# EAGLE board headstage-neuropix (EAGLE 8.3.2)
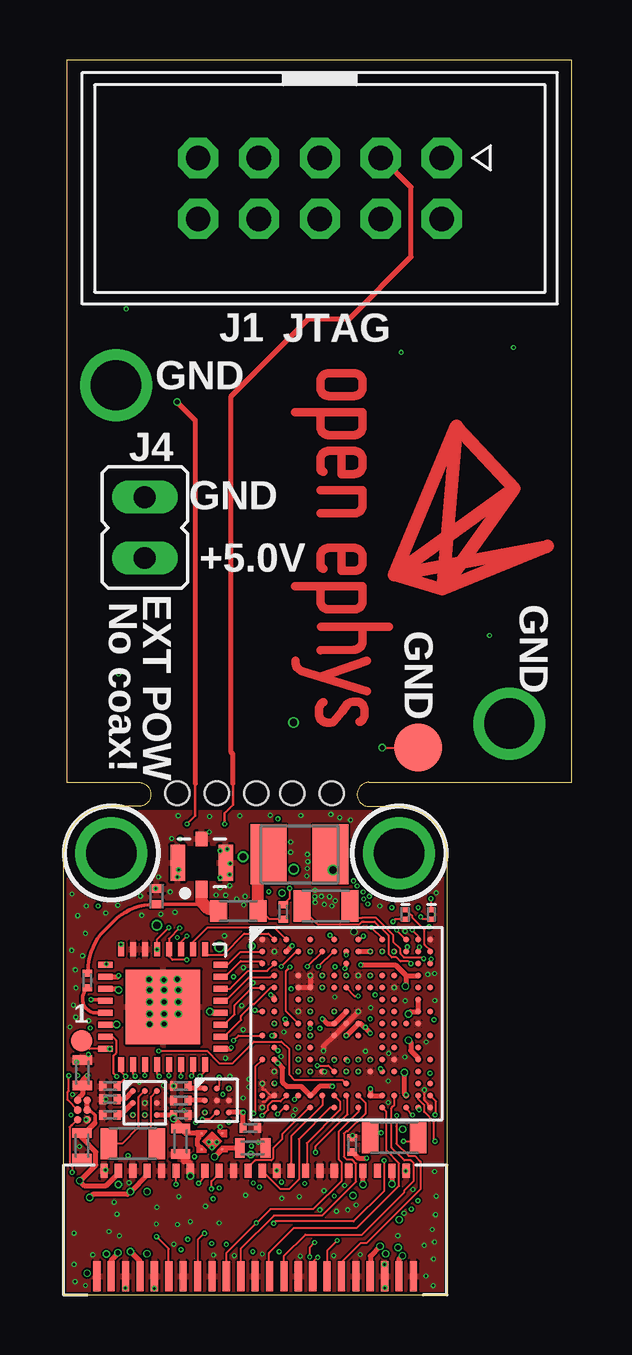
[diagram p5: board, top side]
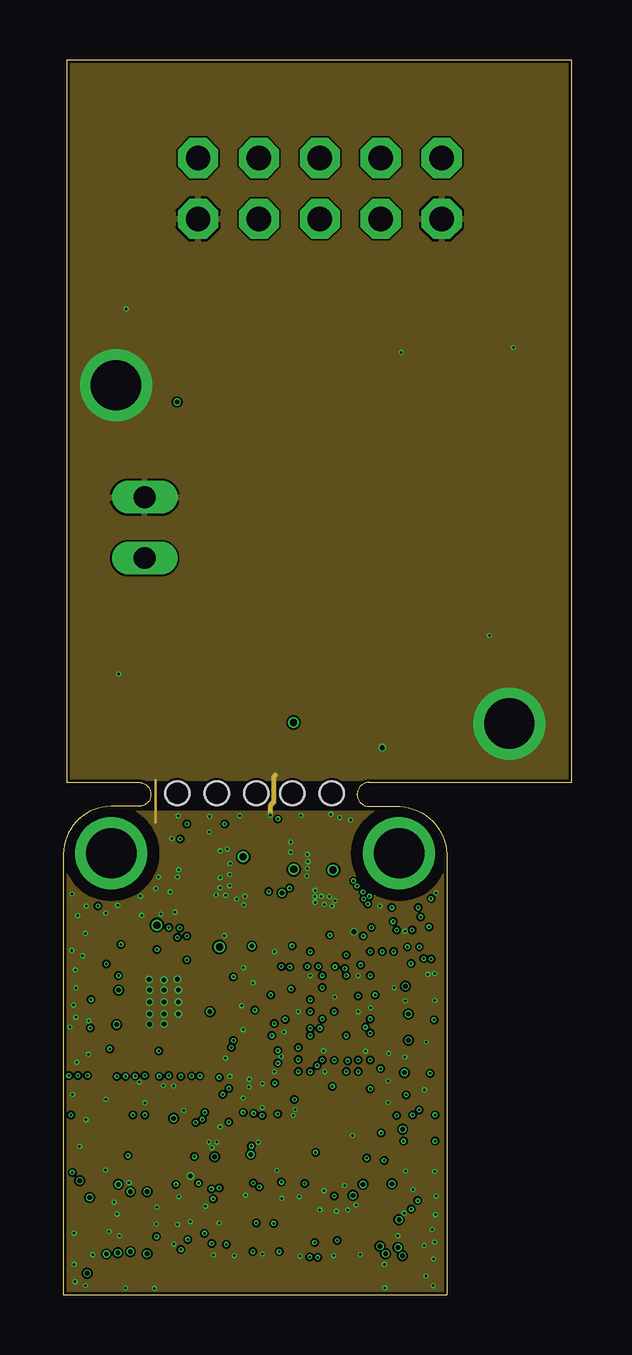
[diagram p6: board, inner layer GND1]
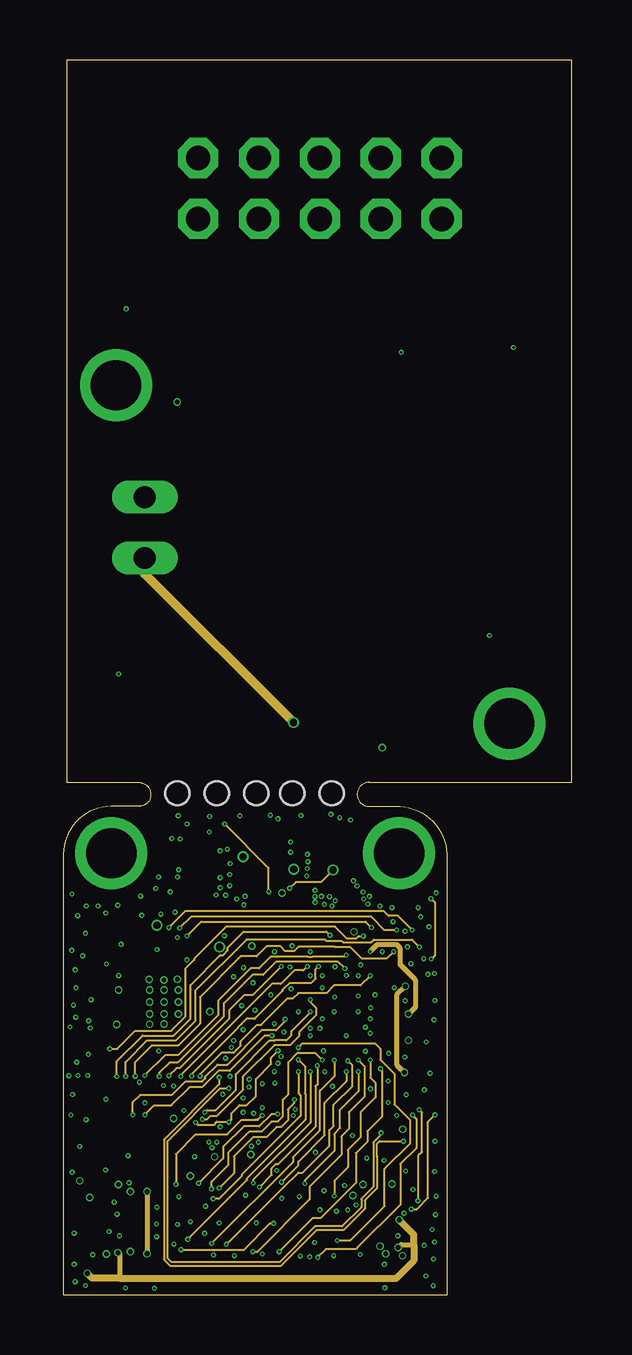
[diagram p7: board, inner layer Highspeed2]
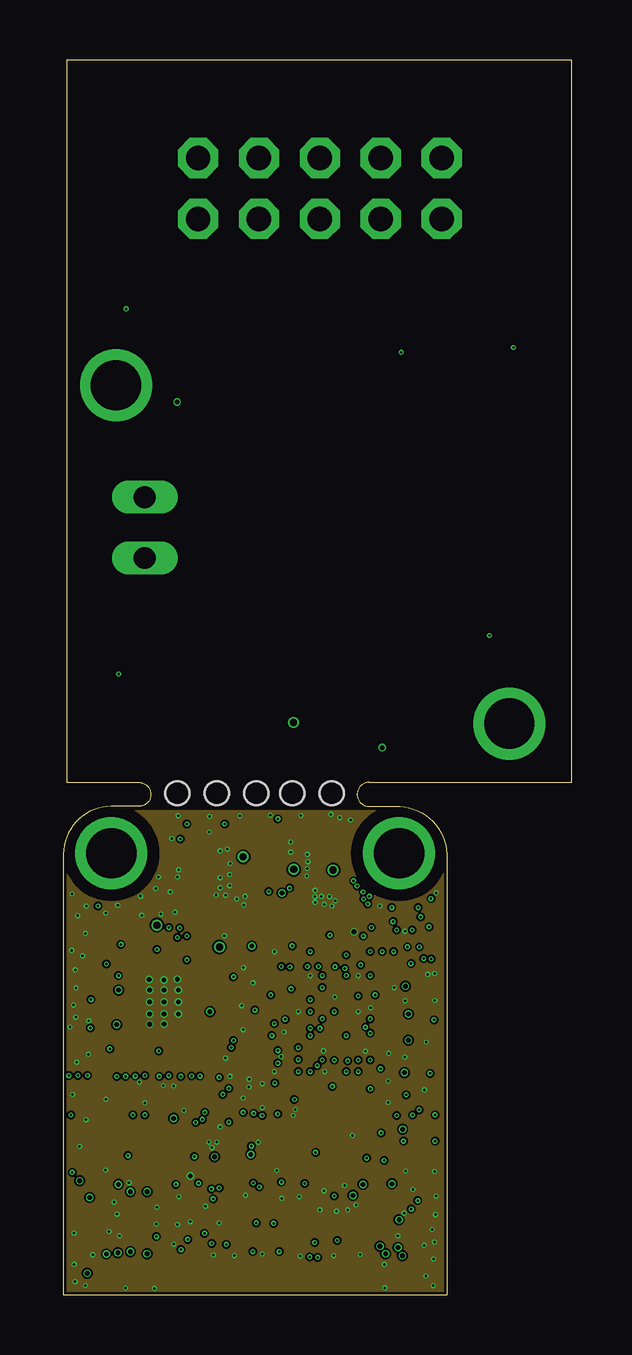
[diagram p8: board, inner layer GND2]
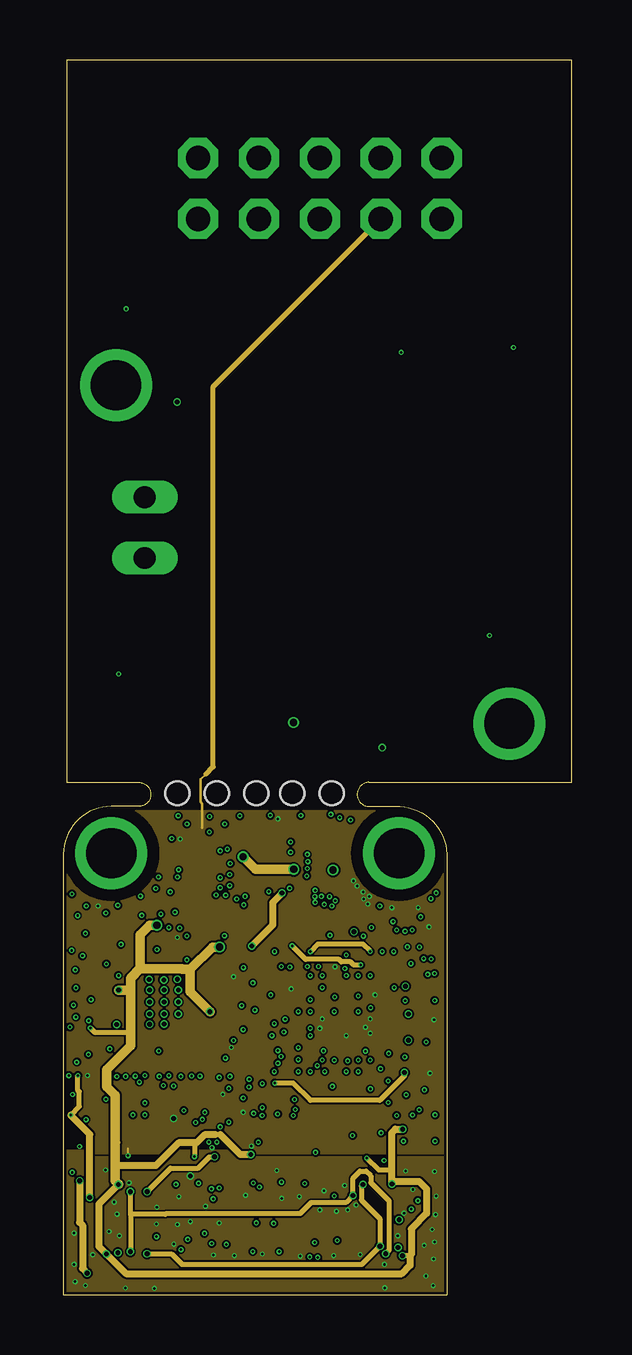
[diagram p9: board, inner layer VCC]
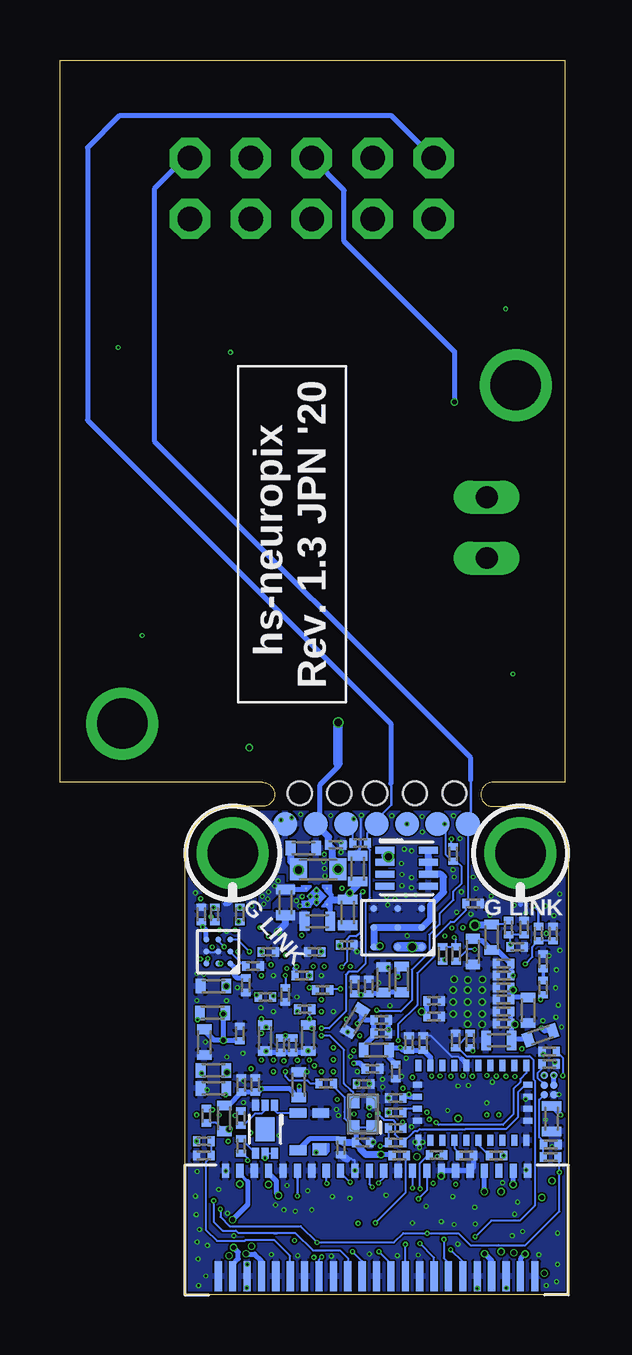
[diagram p10: board, bottom side, seen from below]

Size 21.2 x 51.45 mm. Coordinates in mm from the lower left corner, seen from the top.
Outline: 0.15,51.45 0.15,21.35 3.15,21.35 arc-90 3.65,20.85 arc-90 3.15,20.35 2,20.35 arc90 0,18.35 0,0 16,0 16,18.35 arc90 13.85,20.35 12.75,20.35 arc-90 12.25,20.85 arc-90 12.75,21.35 21.2,21.35 21.2,51.45 0.15,51.45
Copper layers (1*2*3+4*5*16): Highspeed1 0.036mm / dielectric 4mil / GND1 0.036mm / dielectric 5mil / Highspeed2 0.036mm / dielectric 0.10921875mm / GND2 0.036mm / dielectric 5mil / VCC 0.036mm / dielectric 4mil / LowSpeed 0.036mm
Design rules "speedy-6-layer-3mil-trace-space *": minimum track width 3mil, minimum drill 3mil, track to track 3mil, track to pad 3mil, pad to pad 3mil, via to via 3mil, smd to smd 2mil, copper to edge 5mil, drill to drill 5mil, minimum pad ring 2mil, minimum via ring 2mil, stop-mask expansion 0.005mm, vias tented up to drill 1mm, thermal gap 0.1mm
Net classes: 1 diff: width 0.09 mm, drill 0.2 mm, clearance 0.09 mm
Holes 1 mm at 8.05,20.9 4.75,20.9 6.4,20.9 9.55,20.9 11.2,20.9
tKeepout: area 12,16.4 to 16,20.4; area 0,16.4 to 4,20.4
bKeepout: area 11.9,16.3 to 16.1,20.5; area -0.1,16.3 to 4.1,20.5
tRestrict: area -0.1,16.3 to 4.1,20.5; area 11.9,16.3 to 16.1,20.5
bRestrict: area -0.1,16.3 to 4.1,20.5; area 11.9,16.3 to 16.1,20.5
vRestrict: area 11.9,16.3 to 16.1,20.5

## Footprints (pad centres in the part's own frame; a part is rotated, then mirrored left to right if it is on the bottom)
0201T = smd 0.3 x 0.4: 1 -0.3,0; 2 0.3,0
0402T = smd 0.4 x 0.6: 1 -0.533,0; 2 0.533,0
0402TW = smd 0.4 x 0.8: 1 -0.533,0; 2 0.533,0
LED-0201T = smd 0.2 x 0.35: 1 -0.2,0; 2 0.2,0
0402T-DFN = smd 0.35 x 0.6: A -0.325,0; C 0.325,0
0805PT-NOSILK = smd 0.7 x 1.3: A -1,0; C 1,0
2X05_IDC = drill 1.016 pad 1.676 octagon: 1 -5.08,-1.27; 2 -5.08,1.27; 3 -2.54,-1.27; 4 -2.54,1.27; 5 0,-1.27; 6 0,1.27; 7 2.54,-1.27; 8 2.54,1.27; 9 5.08,-1.27; 10 5.08,1.27
X_FL_R_SMT_1(02) = smd 0.5 x 0.7: P$1 0,-1.1 | smd 0.6 x 1.5: P$2 -1,0; P$4 1,0 | smd 0.5 x 0.6: P$3 0,1
FH23-45S-0.3SHW(05) = smd 0.3 x 1.25: 1 -6.6,0.068; 3 -6,0.068; 5 -5.4,0.068; 7 -4.8,0.068; 9 -4.2,0.068; 11 -3.6,0.068; 13 -3,0.068; 15 -2.4,0.068; 17 -1.8,0.068; 19 -1.2,0.068; 21 -0.6,0.068; 23 0,0.068; 25 0.6,0.068; 27 1.2,0.068; 29 1.8,0.068; 31 2.4,0.068; 33 3,0.068; 35 3.6,0.068; 37 4.2,0.068; 39 4.8,0.068; 41 5.4,0.068; 43 6,0.068; 45 6.6,0.068 | smd 0.3 x 0.6: 2 -6.3,4.468; 4 -5.7,4.468; 6 -5.1,4.468; 8 -4.5,4.468; 10 -3.9,4.468; 12 -3.3,4.468; 14 -2.7,4.468; 16 -2.1,4.468; 18 -1.5,4.468; 20 -0.9,4.468; 22 -0.3,4.468; 24 0.3,4.468; 26 0.9,4.468; 28 1.5,4.468; 30 2.1,4.468; 32 2.7,4.468; 34 3.3,4.468; 36 3.9,4.468; 38 4.5,4.468; 40 5.1,4.468; 42 5.7,4.468; 44 6.3,4.468
JP2 = drill 0.914 long: 1 0,0; 2 2.54,0
0603T = smd 0.7 x 0.9: 1 -0.82,0; 2 0.82,0
1210T = smd 1.5 x 2.5: 1 -1.3,0; 2 1.3,0
TP10R = smd 1 x 1: TP 0,0
TP09R = smd 0.9 x 0.9: TP 0,0
TP20R = smd 2 x 2: TP 0,0
MBGA153-8X8 = smd 0.25 x 0.25: A1 -3.5,3.5; A2 -3,3.5; A3 -2.5,3.5; A5 -1.5,3.5; A7 -0.5,3.5; A9 0.5,3.5; A11 1.5,3.5; A13 2.5,3.5; A14 3,3.5; A15 3.5,3.5; B1 -3.5,3; B2 -3,3; B3 -2.5,3; B4 -2,3; B5 -1.5,3; B6 -1,3; B7 -0.5,3; B8 0,3; B9 0.5,3; B10 1,3; B11 1.5,3; B12 2,3; B13 2.5,3; B14 3,3; B15 3.5,3; C1 -3.5,2.5; C2 -3,2.5; C8 0,2.5; C14 3,2.5; C15 3.5,2.5; D2 -3,2; D4 -2,2; D5 -1.5,2; D6 -1,2; D7 -0.5,2; D8 0,2; D9 0.5,2; D10 1,2; D11 1.5,2; D12 2,2; D14 3,2; E1 -3.5,1.5; E2 -3,1.5; E4 -2,1.5; E5 -1.5,1.5; E6 -1,1.5; E7 -0.5,1.5; E8 0,1.5; E9 0.5,1.5; E10 1,1.5; E11 1.5,1.5; E12 2,1.5; E14 3,1.5; E15 3.5,1.5; F2 -3,1; F4 -2,1; F5 -1.5,1; F11 1.5,1; F12 2,1; F14 3,1; G1 -3.5,0.5; G2 -3,0.5; G4 -2,0.5; G5 -1.5,0.5; G7 -0.5,0.5; G8 0,0.5; G9 0.5,0.5; G11 1.5,0.5; G12 2,0.5; G14 3,0.5; G15 3.5,0.5; H2 -3,0; H3 -2.5,0; H4 -2,0; H5 -1.5,0; H7 -0.5,0; H8 0,0; H9 0.5,0; H11 1.5,0; H12 2,0; H13 2.5,0; H14 3,0; J1 -3.5,-0.5; J2 -3,-0.5; J4 -2,-0.5; J5 -1.5,-0.5; J7 -0.5,-0.5; J8 0,-0.5; J9 0.5,-0.5; J11 1.5,-0.5; J12 2,-0.5; J14 3,-0.5; J15 3.5,-0.5; K2 -3,-1; K4 -2,-1; K5 -1.5,-1; K11 1.5,-1; K12 2,-1; K14 3,-1; L1 -3.5,-1.5; L2 -3,-1.5; L4 -2,-1.5; L5 -1.5,-1.5; L6 -1,-1.5; L7 -0.5,-1.5; L8 0,-1.5; L9 0.5,-1.5; L10 1,-1.5; L11 1.5,-1.5; L12 2,-1.5; L14 3,-1.5; L15 3.5,-1.5; M2 -3,-2; M4 -2,-2; M5 -1.5,-2; M6 -1,-2; M7 -0.5,-2; M8 0,-2; M9 0.5,-2; M10 1,-2; M11 1.5,-2; M12 2,-2; M14 3,-2; N1 -3.5,-2.5; N2 -3,-2.5; N8 0,-2.5; N14 3,-2.5; N15 3.5,-2.5; P1 -3.5,-3; P2 -3,-3; P3 -2.5,-3; P4 -2,-3; P5 -1.5,-3; P6 -1,-3; P7 -0.5,-3; P8 0,-3; P9 0.5,-3; P10 1,-3; P11 1.5,-3; P12 2,-3; P13 2.5,-3; P14 3,-3; P15 3.5,-3; R1 -3.5,-3.5; R2 -3,-3.5; R3 -2.5,-3.5; R5 -1.5,-3.5; R7 -0.5,-3.5; R9 0.5,-3.5; R11 1.5,-3.5; R13 2.5,-3.5; R14 3,-3.5; R15 3.5,-3.5
ASCO = smd 0.6 x 0.5: 1 -0.55,-0.4; 2 0.55,-0.4; 3 0.55,0.4; 4 -0.55,0.4
UDFN8-2X2 = smd 0.8 x 0.3: 1 -0.91,0.75; 2 -0.91,0.25; 3 -0.91,-0.25; 4 -0.91,-0.75; 5 0.91,-0.75; 6 0.91,-0.25; 7 0.91,0.25; 8 0.91,0.75
WLCSP6-1X1.2-LP = smd 0.305 x 0.305: A1 -0.2,0.4; A2 0.2,0.4; B1 -0.2,0; B2 0.2,0; C1 -0.2,-0.4; C2 0.2,-0.4
WQFN32-5X5-LP = smd 0.25 x 0.6: 1 1.75,2.4; 2 1.25,2.4; 3 0.75,2.4; 4 0.25,2.4; 5 -0.25,2.4; 6 -0.75,2.4; 7 -1.25,2.4; 8 -1.75,2.4; 17 -1.75,-2.4; 18 -1.25,-2.4; 19 -0.75,-2.4; 20 -0.25,-2.4; 21 0.25,-2.4; 22 0.75,-2.4; 23 1.25,-2.4; 24 1.75,-2.4 | smd 0.6 x 0.25: 9 -2.4,1.75; 10 -2.4,1.25; 11 -2.4,0.75; 12 -2.4,0.25; 13 -2.4,-0.25; 14 -2.4,-0.75; 15 -2.4,-1.25; 16 -2.4,-1.75; 25 2.4,-1.75; 26 2.4,-1.25; 27 2.4,-0.75; 28 2.4,-0.25; 29 2.4,0.25; 30 2.4,0.75; 31 2.4,1.25; 32 2.4,1.75 | smd 3.1 x 3.1: PAD 0,0
X2SON = smd 0.1 x 0.1: 1 -0.43,0.33; 2 -0.43,-0.33; 3 0.43,-0.33; 4 0.43,0.33 | smd 0.1 x 0.1 rotated 45: PAD 0,0
MICROSIP9-3X2.3 = smd 0.3 x 0.3: A1 -1,0.8; A2 0,0.8; A3 1,0.8; B1 -1,0; B2 0,0; B3 1,0; C1 -1,-0.8; C2 0,-0.8; C3 1,-0.8
LGA-28-3.8X2.5-LP = smd 0.25 x 0.475: 1 -2.25,1.56; 6 -2.25,-1.56; 7 -1.75,-1.56; 8 -1.25,-1.56; 9 -0.75,-1.56; 10 -0.25,-1.56; 11 0.25,-1.56; 12 0.75,-1.56; 13 1.25,-1.56; 14 1.75,-1.56; 15 2.25,-1.56; 20 2.25,1.56; 21 1.75,1.56; 22 1.25,1.56; 23 0.75,1.56; 24 0.25,1.56; 25 -0.25,1.56; 26 -0.75,1.56; 27 -1.25,1.56; 28 -1.75,1.56 | smd 0.375 x 0.25: 2 -2.3,0.75; 3 -2.3,0.25; 4 -2.3,-0.25; 5 -2.3,-0.75; 16 2.3,-0.75; 17 2.3,-0.25; 18 2.3,0.25; 19 2.3,0.75
VFLGA4-2.0X1.6 = smd 0.5 x 0.57: 1 -0.725,-0.425 | smd 0.4 x 0.7: 2 0.775,-0.475; 3 0.775,0.475; 4 -0.775,0.475
DFN6_2X1.3_PAD = smd 0.45 x 0.3: 1 -1,0.4; 2 -1,0; 3 -1,-0.4; 4 1,-0.4; 5 1,0; 6 1,0.4 | smd 1 x 0.8: PAD 0,0
WLCSP3X3 = smd 0.25 x 0.25: A1 -0.5,0.5; A2 0,0.5; A3 0.5,0.5; B1 -0.5,0; B2 0,0; B3 0.5,0; C1 -0.5,-0.5; C2 0,-0.5; C3 0.5,-0.5

## Placement (x,y rotation side)
C1  22nF  [0201T]  9.24,14.58 0 bottom
C2  22nF  [0201T]  11.5,10.4 270 bottom
C3  0.1uF  [0201T]  8.53,8.78 0 bottom
C4  0.1uF  [0201T]  12,10.4 270 bottom
C5  4.7uF  [0402T]  14.8,12.86 180 bottom
C6  4.7uF  [0402T]  12.65,10.7 270 bottom
C7  10uF  [0402T]  14.8,8.6 180 bottom
C8  10uF  [0402T]  10.85,10.7 270 bottom
C9  22nF  [0201T]  8.17,9.42 0 bottom
C10  22nF  [0201T]  13.7,10.89 90 bottom
C11  10nF  [0201T]  8.58,6.34 180 bottom
C12  22nF  [0201T]  8.32,12.85 90 bottom
C13  22nF  [0201T]  7.8,11.45 0 bottom
C14  22nF  [0201T]  13.64,8.75 90 bottom
C15  22nF  [0201T]  12.51,14.29 0 bottom
C16  0.1uF  [0201T]  8.91,12.84 90 bottom
C17  0.1uF  [0201T]  7.8,10.9 0 bottom
C18  0.1uF  [0201T]  13.05,8.75 90 bottom
C19  0.1uF  [0201T]  10.58,14.29 180 bottom
C20  10uF  [0402T]  8.9,11.42 238.2 bottom
C21  10uF  [0402T]  11.25,8.75 90 bottom
C22  10uF  [0402T]  15.18,10.53 270 bottom
C23  10uF  [0402T]  7.71,13.13 90 bottom
C24  10uF  [0402TW]  0.8,9.25 90 top
C25  1uF  [0201T]  9.7,18.75 0 bottom
C26  10uF  [0402TW]  9.2,15.93 270 bottom
C27  0.1uF  [0201T]  7.2,8.2 180 bottom
C28  10uF  [0402TW]  8.78,17.76 90 bottom
C29  0.1uF  [0201T]  6.05,10.5 90 bottom
C30  1nF  [0201T]  0.8,10.14 180 bottom
C31  0.1uF  [0201T]  5.6,12.25 0 bottom
C32  0.1uF  [0201T]  7.2,9.3 270 bottom
C33  10uF  [0402TW]  0.78,6.21 270 top
C34  10nF  [0201T]  5.6,11.6 0 bottom
C35  10nF  [0201T]  6.65,10.5 90 bottom
C36  10uF  [0402TW]  10.47,15.56 180 bottom
C37  10uF  [0402TW]  4.89,6.4 270 top
C38  1uF  [0201T]  0.73,6.26 0 bottom
C39  0.1uF  [0201T]  4.25,5.8 180 bottom
C40  10nF  [0201T]  2.7,13.8 180 bottom
C41  10nF  [0201T]  2.7,12.8 180 bottom
C42  10nF  [0201T]  2.7,11.8 180 bottom
C43  1nF  [0201T]  0.8,9.62 0 bottom
C44  0.1uF  [0201T]  2.7,13.3 180 bottom
C45  0.1uF  [0201T]  2.7,12.3 180 bottom
C46  0.1uF  [0201T]  2.7,11.3 180 bottom
C47  10uF  [0402TW]  11.8,16.35 270 bottom
C48  10uF  [0402TW]  7.9,6.12 0 top
C49  0.1uF  [0201T]  1,13.1 270 top
C50  47nF  [0201T]  1.05,12.8 270 bottom
C51  10uF  [0402TW]  0.7,7.34 270 bottom
C52  4.7uF  [0402T]  3.98,14.3 270 bottom
C53  10uF  [0402T]  1.68,11.86 270 bottom
C54  10uF  [0402TW]  2.9,10.6 180 bottom
C55  1uF  [0201T]  0.63,15.05 90 bottom
C56  10nF  [0201T]  9.48,6.13 90 bottom
C57  0.1uF  [0201T]  2.13,14.5 0 bottom
C58  10uF  [0402T]  11.05,18.61 0 bottom
C59  10nF  [0201T]  12.05,6.25 270 top
C60  1uF  [0201T]  1.95,8.15 180 top
C61  1uF  [0201T]  4.9,8.7 180 top
C62  1uF  [0201T]  13.45,12.9 270 bottom
C63  0.1uF  [0201T]  4.9,7.5 0 top
C64  0.1uF  [0201T]  7.8,6.95 0 top
C65  0.1uF  [0201T]  15.3,15.85 90 bottom
D1  XZVGR155W  [LED-0201T]  15.35,15.85 270 top
D2  XZVGR155W  [LED-0201T]  14.25,15.85 270 top
D3  SESD0402X1UN-0020-090  [0402T-DFN]  3.89,16.6 270 top
D4  VEMD1160X01  [0805PT-NOSILK]  2.9,6.3 0 top
D5  VEMD1160X01  [0805PT-NOSILK]  13.8,6.55 180 top
D6  VEMD1160X01  [0805PT-NOSILK]  10.95,16.2 0 top
J1  302-S101  [2X05_IDC]  10.7,46.1 180 top
J2  X.FL-R-SMT-1(02)  [X_FL_R_SMT_1(02)]  5.77,18 0 top
J3  FH23-45S-0.3SHW(05)  [FH23-45S-0.3SHW(05)]  8,0.7 0 top
J4  77311-118-02LF  [JP2]  3.4,30.7 90 top
J5  FH23-45S-0.3SHW(05)  [FH23-45S-0.3SHW(05)]  8,0.7 0 bottom
L1  BLM15PX601SN1D  [0402T]  14.8,9.35 0 bottom
L2  BLM15PX601SN1D  [0402T]  6.95,13.14 270 bottom
L3  BLM15PX601SN1D  [0402T]  8,10.2 180 bottom
L4  BLM15PX601SN1D  [0402T]  14.35,7.35 90 bottom
L5  BLM15PX601SN1D  [0402T]  14.84,11.75 0 bottom
L6  BLM15PX601SN1D  [0402T]  3.2,14.9 270 bottom
L7  BLM15PX601SN1D  [0402T]  1.16,10.82 198.9 bottom
L8  BLM18KG601SN1D  [0603T]  10.43,17.73 0 bottom
L9  ADL3225V-470MT-TL000  [1210T]  9.85,18.35 0 top
L10  MPZ1608S102ATA00  [0603T]  7.3,16 0 top
R1  4.7k  [0201T]  7.2,6.35 180 bottom
R2  4.7k  [0201T]  7.2,6.95 180 bottom
R3  2k  [0201T]  14.75,15.85 270 bottom
R4  4.7k  [0201T]  10.1,8.8 0 bottom
R5  10k  [0201T]  11,11.9 180 bottom
R6  2k  [0201T]  13.7,15.85 270 bottom
R7  4.7k  [0201T]  15.1,7.46 270 bottom
R8  10k  [0201T]  4.8,18.37 270 bottom
R9  1k  [0201T]  3.97,16.3 0 bottom
R10  4.7k  [0201T]  5.5,5.82 0 bottom
R11  4.7k  [0201T]  5.24,14.2 90 bottom
R12  10k  [0201T]  11.8,12.5 270 bottom
R13  10k  [0201T]  8.68,18.83 0 bottom
R14  4.7k  [0201T]  7.05,5.8 180 bottom
R15  4.7k  [0201T]  4.68,14.2 90 bottom
R16  10k  [0201T]  12.63,12.41 0 bottom
R17  10k  [0201T]  11.1,13.3 0 bottom
R18  10k  [0201T]  10.25,12.7 180 bottom
R19  10k  [0201T]  1.95,8.7 180 top
R20  10k  [0201T]  3,5.8 0 bottom
R21  6.6k  [0201T]  0.74,5.74 0 bottom
R22  10k  [0201T]  1.25,15.05 270 bottom
R23  49.9  [0201T]  1.05,13.9 270 bottom
R24  10k  [0201T]  7.2,7.6 0 bottom
R25  10k  [0201T]  2.5,15.3 270 bottom
R26  100k  [0201T]  1.85,15.3 90 bottom
R27  2k  [0201T]  9.17,15.95 90 top
R28  22  [0201T]  13.65,6.2 270 bottom
R29  20k  [0201T]  4.1,10.6 90 bottom
R30  100  [0201T]  4.7,10.6 90 bottom
R31  22  [0201T]  13.66,7.36 90 bottom
R32  15k  [0201T]  1.95,7.5 0 top
R33  15k  [0201T]  4.9,8.1 0 top
R34  15k  [0201T]  13.15,13.7 180 bottom
R35  20k  [0201T]  15.2,6.4 0 bottom
R36  100  [0201T]  15.2,5.8 180 bottom
TP1  [TP10R]  10.54,19.62 180 bottom
TP2  [TP10R]  5.46,19.62 180 bottom
TP3  [TP10R]  4.19,19.62 180 bottom
TP4  [TP10R]  8,19.62 180 bottom
TP5  [TP10R]  6.73,19.62 180 bottom
TP6  [TP10R]  9.27,19.62 180 bottom
TP7  [TP10R]  11.81,19.62 180 bottom
TP8  [TP09R]  0.76,10.58 0 top
TP9  [TP20R]  14.8,22.8 270 top
U1  10M08SAM15317G  [MBGA153-8X8]  11.8,11.3 0 top
U2  ASCO2-24.000MHZ-EK-T3  [ASCO]  8.57,7.53 90 bottom
U3  MAX4945AELA+T  [UDFN8-2X2]  6.74,17.77 0 bottom
U4  ADP7112ACBZ-1.8-R7  [WLCSP6-1X1.2-LP]  0.8,7.7 0 top
U5  DS90UB933_WQFN  [WQFN32-5X5-LP]  4.16,12 0 top
U6  NCP161BMX330  [X2SON]  10.5,16.6 0 bottom
U7  TPS8268180  [MICROSIP9-3X2.3]  7.11,15.3 180 bottom
U8  TLV70712  [X2SON]  6.2,6.4 180 top
U9  ADP7112ACBZ-1.2-R7  [WLCSP6-1X1.2-LP]  0.81,8.74 0 bottom
U10  BNO055  [LGA-28-3.8X2.5-LP]  4,8 0 bottom
U11  DSC6102MI2A-093.6000  [VFLGA4-2.0X1.6]  10.8,6.8 90 bottom
U12  PL133-27GC-R  [DFN6_2X1.3_PAD]  12.65,6.9 270 bottom
U13  TS4231  [WLCSP3X3]  3.4,8 0 top
U14  TS4231  [WLCSP3X3]  6.4,8.1 0 top
U15  TS4231  [WLCSP3X3]  14.6,14.3 180 bottom
X2  OE-LOGO_14X10  [OE-LOGO-14X10]  13.4,31.8 270 top

## Tracks (layer width: path | path; a pad name or v marks a point on that pad's centre or on a via)
1V2A  (via drill 0.1, 0.2)
  Highspeed1 0.2: J3.7 3.2,1.4 v2.8,1.8 | J3.8 3.5,5 v2.8,4.3 2.68,4.18 1.23,4.18 v1.1,4.05
  VCC 0.2: 2.8,3.35 v2.8,4.3 | 2.8,3.35 v2.8,1.8 | 2.8,3.35 4.26,3.35 4.29,3.38 9.88,3.38 10.34,3.84 11.78,3.84 v12.08,4.14 12.08,4.86 12.37,5.15 12.63,5.15 12.83,4.95 12.83,4.67 13.6,3.9 13.6,1.87 v13.44,1.71 | U9.A2 0.61,8.52 0.67,8.46 0.67,7.84 v0.32,7.49
  VCC 0.3: v1.1,4.05 1.1,6.68 0.32,7.47 v0.32,7.49
  LowSpeed 0.2: v13.44,1.71 13.36,1.71 13.34,1.69 13.08,1.69 12.8,1.41 J5.7 | v12.08,4.14 12.17,4.23 12.17,4.73 12.5,5.06 J5.8 | U9.B2 U9.A2 | v0.32,7.49 C51.1
  other vias: 0.61,9.14
1V8A  (via drill 0.2)
  Highspeed1 0.15: 1.33,7.16 1.33,7.47 1.1,7.7 U4.B2
  Highspeed1 0.2: J3.4 2.3,5.07 1.76,4.53 1.24,4.53 0.9,4.53 v0.68,4.75 0.7,4.75 1.36,5.4 1.36,5.95 0.78,6.53 C33.1 0.91,6.74 1.33,7.16 | J3.3 2,1.44 2.28,1.71 v2.28,1.76 | U4.B2 U4.A2
  Highspeed2 0.2: 2.34,0.7 2.34,1.76 v2.28,1.76 | v13.96,1.97 14.08,2.09 14.62,2.09
  Highspeed2 0.3: v1,0.9 1.2,0.7 2.34,0.7 13.9,0.7 14.62,1.42 14.62,2.09 14.62,2.51 v14,3.12
  VCC 0.3: v1,0.9 0.8,1.1 0.8,2.9 0.68,3.02 v0.68,4.75
  LowSpeed 0.15: J5.4 13.7,5.05 13.37,4.72
  LowSpeed 0.2: J5.3 14,0.94 14.01,0.94 14.01,1.25 13.77,1.5 13.77,1.78 v13.96,1.97 | v14,3.12 13.37,3.76 13.37,4.72
24MHZ_P  (via drill 0.1)
  LowSpeed 0.076: U1.J5 9.95,10.8 9.36,10.21 9.36,8.8 9.09,8.54 9.09,8.53 8.97,8.41 U2.3
  other vias: 10.3,10.8
!IMU_BL
  LowSpeed 0.076: U10.4 6.75,7.75 R24.2
!IMU_RESET
  LowSpeed 0.076: U10.11 3.75,6.25 R20.1
+1V2  (via drill 0.2)
  Highspeed1 0.076: 6.86,6.12 6.81,6.07 U8.1
  Highspeed1 0.2: v13.21,2.02 12.8,1.61 J3.39 | v12.5,4.6 J3.38 | 6.86,6.12 C48.1 | U8.1 v6.31,5.75
  Highspeed2 0.2: v3.49,1.71 v3.5,1.72 v3.5,4.3
  VCC 0.2: v6.31,5.75 6.1,5.75 5.62,5.28 4.47,5.28 v3.5,4.3 | v12.5,4.6 12.43,4.53 12.43,3.94 13.2,3.17 v13.2,2.03 v13.21,2.02 12.45,1.26 10.47,1.26 10.46,1.27 4.95,1.27 4.51,1.71 v3.49,1.71
  LowSpeed 0.2: v3.5,4.3 J5.38 | J5.39 3.2,1.42 v3.49,1.71
+1V8  (via drill 0.1, 0.2, 0.3)
  Highspeed1 0.2: U5.28 6.16,11.75 v6.11,11.8 | U5.11 2.31,12.75 v2.31,12.7 | J3.42 v13.7,4.62 | C59.2 12.3,5.7 v12.65,5.7 | J3.43 14,1.48 v14.15,1.63
  VCC 0.2: 13.7,5.19 13.16,5.19 v12.65,5.7 | 5.45,6.35 5.47,6.33 v5.47,5.76 | 6.35,6.69 6.54,6.69 6.55,6.67 | 14.46,1.62 v14.16,1.62 v14.15,1.63 | 2.78,10.6 2.81,10.57 | v1.13,11.12 1.31,10.93 2.73,10.93 2.81,11.01
  VCC 0.3: v14.15,6.9 13.85,6.9 13.7,6.75 13.7,5.19 v13.7,4.62 13.8,4.72 14.84,4.72 15.15,4.41 15.15,3.39 14.51,2.75 14.51,1.67 14.46,1.62 14.46,1.23 14.12,0.88 2.62,0.88 v1.8,1.7 1.49,2.01 1.49,3.79 v2.3,4.6 | v7.82,5.85 7.37,5.85 6.55,6.67 | 6.35,6.69 5.92,6.69 5.58,6.35 5.45,6.35 4.83,6.35 3.87,5.39 2.16,5.39 | 2.23,6.35 2.16,6.42
  VCC 0.4: 2.81,12.7 2.81,13.2 3.21,13.6 | 2.81,12.7 2.81,11.01 2.81,10.57 2.81,10.38 1.8,9.37 1.8,8.66 2.16,8.31 2.16,6.42 2.16,5.39 2.16,4.74 v2.3,4.6 | v2.31,12.7 2.81,12.7 | 3.21,13.6 3.21,15.01 3.6,15.4 v3.9,15.4 | 5.29,13.57 5.29,12.62 v6.11,11.8 | 5.29,13.57 5.3,13.58 5.31,13.58 6.22,14.49 v6.51,14.49 | 5.29,13.57 4.96,13.57 4.96,13.58 3.23,13.58 3.21,13.6
  LowSpeed 0.076: L4.1 14.69,7.16 R7.2 | R25.1 2.67,15.43 L6.1 | U2.1 8.84,6.98 U2.4 9.35,7.36 9.35,7.62 9.33,7.63 9.33,8.23 9.8,8.7 R4.2 | 8.85,6.37 C11.2 | U12.5 U12.6
  LowSpeed 0.15: 12.65,6.05 U12.5 | L4.1 14.17,6.82 14.15,6.8
  LowSpeed 0.2: 5.9,11.8 C31.1 | 5.9,11.8 C34.1 | v6.11,11.8 5.9,11.8 | v2.3,4.6 J5.42 | v7.82,5.85 7.4,5.85 R14.2 | R10.2 5.26,5.76 v5.47,5.76 | U12.5 v12.65,5.7 | v1.8,1.7 2,1.5 J5.43 | 8.85,6.86 U2.4 8.81,6.98 | C11.2 8.84,6.38 8.84,6.98 | C53.1 2.31,12.39 C45.1 | U11.4 10.8,6.5 9.55,6.5 C56.2 | L7.1 1,10.99 v1.13,11.12
  LowSpeed 0.203: C41.1 v2.31,12.7
  LowSpeed 0.3: L6.1 3.23,15.4 v3.9,15.4 | C45.1 C41.1 | L4.1 14.23,6.82 v14.15,6.9 | C56.2 9.39,6.34 C11.2 8.66,6.12 8.66,6.05 8.46,5.85 v7.82,5.85
  LowSpeed 0.4: 6.52,14.5 U7.A2 | 6.52,14.5 v6.51,14.49 | U7.A1 6.52,14.5
+3V3  (via drill 0.1, 0.2)
  Highspeed1 0.2: U1.J8 U1.H9 12.4,11.3 v12.8,10.9 | U1.G8 U1.H7 11,11.3 v10.8,11.5 | U8.3 5.65,6.73 | U13.C3 C63.1 v4.6,7.35 4.89,7.06 C37.1 5.09,6.73 5.65,6.73 | U14.C3 R24.1 C64.1 | U5.25 6.96,10.25 v7.01,10.3 | 5.65,6.73 5.65,6.54 5.6,6.48 5.6,6.24 U8.4 | U9.A1 0.8,8.93 C24.1 0.8,8.37 0.6,8.16 U4.A1
  VCC 0.076: R20.2 2.7,6.09
  VCC 0.1: 5.95,21.7 5.72,21.47 5.72,20.54 5.79,20.47 5.79,19.45
  VCC 0.2: J1.4 6.25,37.84 6.25,22 5.95,21.7
  LowSpeed 0.076: C64.1 R1.2 7.66,6.19 v7.84,6.19 | R11.2 R15.2 4.68,14.81 v4.76,14.89 | R6.1 v13.7,16.13 | R5.1 10.8,11.8 v10.8,11.5 | R18.1 9.9,12.75 v9.5,12.75 | TP6.TP 9.27,19.56 8.98,19.27 R13.1 | R8.1 4.88,18.75 v4.88,19
  LowSpeed 0.1: v1.45,16.2 1.25,16 R22.1
  LowSpeed 0.15: 6.6,8.25 6.66,8.26
  LowSpeed 0.2: C2.1 11.75,10.7 | 11.75,10.7 C4.1 | 11.75,10.7 11.75,10.75 arc-90 U1.J8 | 6.6,8.25 U10.3 | 6.6,8.25 6.85,8.25 C27.1 | v11.33,13.67 11.4,13.6 R17.1 | TP6.TP 9.16,19.62 v8.95,19.83 | U6.1 10.98,16.88 C47.1 | U15.C3 15.1,15.18 v15.25,15.33 15.25,15.5 C65.1 | C32.1 7.47,9.87 L3.1 7.37,10.3 v7.01,10.3 6.91,10.2 C35.1 C29.1 5.75,9.9 U10.28 | v10.8,11.5 10.8,11.28 C8.1 | v12.8,11.5 12.8,11.38 C6.1 | L5.1 15.37,11.55 v15.46,11.46 | R3.1 14.78,16.15 v14.8,16.13 | v6.65,8.35 6.65,8.3 6.6,8.25 | v7.1,13.25 7.1,13.52 L2.1
  LowSpeed 0.203: R16.1 v12.99,12.51 v13,12.5 | L1.1 15.33,9.27 v15.29,9.23
  LowSpeed 0.3: C47.1 11.75,16.93
  other vias: 11.8,10.8 7.5,7.6 10.7,11.1 12.6,11.15 2.7,5.8 12.25,17.03 12.5,16.78 12.76,16.6 12.7,16.28 12.1,17.25 12.53,16.49 1.01,9.14
  pour VCC (rank 3, no thermals): 0,20.15 0,5.9 16,5.9 16.05,15.75 16,20.15
  pour LowSpeed (rank 2, no thermals): 11.45,17.1 11.45,16.65 12.2,16.65 12.45,16.4 12.45,16.1 12.9,16.1 12.9,16.65 12.08,17.47 11.85,17.47 11.85,17.1
BNO_SCL  (via drill 0.1)
  Highspeed1 0.076: U1.L1 8,9.5 8,7.62 v7.94,7.56
  LowSpeed 0.076: U10.19 1.8,8.75 2.1,8.45 2.1,7.4 2.6,6.9 4.3,6.9 6.21,6.9 6.3,6.81 6.42,6.81 6.45,6.78 6.47,6.78 R1.1 | v7.94,7.56 7.76,7.38 7.76,7.35 7.7,7.29 7.32,7.29 7.24,7.2 7.24,6.69 R1.1 | R1.1 6.86,6.35
BNO_SDA  (via drill 0.1)
  Highspeed1 0.076: v8.95,10.17 8.82,10.3 U1.K2
  Highspeed2 0.076: v8.95,10.17 8.66,9.89 8.66,9.62 8.03,8.99 8.03,8.28 7.65,7.9 7.35,7.9 7,7.55 7,7.29 v6.91,7.2 6.89,7.21 6.41,7.21 | v5.52,7.18 5.6,7.09 6.29,7.09 6.36,7.16 | 6.36,7.16 6.41,7.21 | 6.41,7.21 6.36,7.16
  LowSpeed 0.076: U10.20 1.75,9.25 2.01,8.99 2.01,8.86 2.29,8.59 2.29,7.52 2.73,7.08 5.42,7.08 v5.52,7.18 | R2.1 v6.9,7.19 v6.91,7.2
CAL_A_1KHZ  (via drill 0.1)
  Highspeed1 0.076: U1.N8 11.65,8.95 9.65,8.95 9.43,9.18 9.43,10.22 9.1,10.55 7.95,10.55 7.05,9.64 6.5,9.64 5.99,10.16 v3.98,10.16
  LowSpeed 0.076: R29.1 4.1,10.28 v3.98,10.16
CAL_B_1KHZ  (via drill 0.1)
  Highspeed1 0.076: U1.P14 14.8,8.15 15.05,7.89 15.05,7.62 15.46,7.21 15.46,6.44 R35.1
  other vias: 15.5,6.4
CAL_SIGNAL_A  (via drill 0.1)
  Highspeed1 0.076: 4.4,0.29 J3.11 4.4,1.91 v3.88,2.42
  LowSpeed 0.076: v3.88,2.42 3.22,3.09 2.02,3.09 1.4,3.71 1.4,8.92 1.46,8.98 1.46,9.79 1.61,9.95 4.26,9.95 4.61,10.3 R30.1 R29.2
CAL_SIGNAL_A1
  LowSpeed 0.076: R35.2 R36.1 14.9,5.75 15.11,5.54 15.11,2.7 14.66,2.25 13.5,2.25 13.46,2.29 12.27,2.29 11.6,1.62 J5.11
CONF_DONE  (via drill 0.1)
  LowSpeed 0.076: R18.2 10.65,12.8 U1.E6
  other vias: 10.8,12.8
CONFIG_SEL  (via drill 0.1)
  Highspeed1 0.09: U1.D8
  LowSpeed 0.076: U1.D8 R12.1
  other vias: 11.8,13.3
GND  (via drill 0.1, 0.2, 2.1 pad 3)
  Highspeed1 0.076: U1.R15 15.21,7.89 15.21,7.96 15.06,8.11 v15.06,8.54
  Highspeed1 0.09: v13.3,22.8 TP9.TP
  Highspeed1 0.1: U1.M6 v10.9,9.3 | 8.33,8.05 8.4,8.05 8.58,8.22 8.72,8.22 U1.P2 8.65,8.3 8.4,8.55 8.32,8.55 8.3,8.57 U1.N1
  Highspeed1 0.2: U1.G9 U1.H8 U1.J7 10.85,10.35 C8.2 | U1.D5 U1.E5 U1.E4 | C59.1 v12.06,6.64 | v5.3,4.95 5.3,5.46 5.22,5.54 5.03,5.54 5.03,5.77 4.99,5.77 C37.2
  GND1 0.1: 3.85,21.45 3.85,19.7
  GND1 0.2: 8.85,21.65 8.78,21.58 8.78,20.52 8.63,20.37 v8.63,19.98
  LowSpeed 0.076: U15.B3 14.96,14.3 14.94,14.28 14.76,14.28 14.74,14.3 U15.B2 | v8.63,19.98 8.66,19.95 8.66,18.64 8.67,18.63 | J5.20 8.9,5.61 8.91,5.61 8.92,5.62 8.99,5.62 9.03,5.66 9.22,5.66 | U10.25 4.51,9.82 4.51,9.85 4.58,9.91 4.85,9.91 5.74,10.8 C29.2
  LowSpeed 0.1: v10.9,9.3 11.23,9.3 C21.2
  LowSpeed 0.127: 8.67,18.63 8.69,18.61 8.69,18.57 8.78,18.48 C28.2
  LowSpeed 0.15: v0.8,14.13 0.98,14.13 R23.1
  LowSpeed 0.2: C6.2 arc-90 12.53,10.1 C4.2 C2.2 10.97,10.1 arc-90 C8.2 | C13.2 v7.5,11.05 C17.2 | 8.14,6.36 v8.13,6.36 | v2,18.4 2,16.26 | v14,18.4 14,16.5 14.22,16.28 14.3,16.28 | C1.2 8.94,14.43 v8.81,14.3 | C39.1 3.95,5.32 J5.36 J5.34 J5.32 v5.3,4.95 | U10.25 4.25,9.63 4.45,9.83 | U9.C2 v0.39,8.34 v0.39,8.35
  LowSpeed 0.3: v12.12,15.13 11.8,15.45 C47.2 | U6.PAD 10.83,16.27 U6.2 | C11.1 8.26,6.36 8.14,6.36 | 9.22,5.66 9.26,5.69 9.34,5.69 C56.1
  other vias: 3.58,13.14 4.19,13.12 4.76,13.15 4.8,12.7 4.2,12.7 3.6,12.7 3.6,12.2 3.6,11.7 4.2,12.2 4.2,11.7 3.6,11.27 4.2,11.28 12.3,11.8 4.8,12.2 4.8,11.7 12.6,10.15 13.55,8.91 12.3,13.3 14.25,12.25 14.24,9.91 7.51,13.63 8.3,8.8 8.3,7.8 7.5,8.2 10.85,10.17 9.8,11.8 9.2,10.95 6.54,7 6.95,9.1 7.75,8.98 10.3,13.3 13.8,12.8 4.6,8.7 5.03,7.68 1.78,8.15 11.73,4.56 14.28,5.16 9.88,1.61 8.3,1.7 6.26,1.66 7.13,1.63 10.7,3.54 7.6,4.15 5.3,3.05 3.9,3.65 3.85,16.93 10.5,16.85 0.36,16.7 15.48,5.14 6.94,17.51 7.53,16.25 0.45,1.27 4.52,19.01 10.17,17.76 3.97,17.41 3.22,16.61 2.27,16.23 1.77,15.91 0.92,15.06 3.27,15.81 4.07,15.86 12.82,11.96 11.32,12.41 13.57,10.06 3.17,8.86 2.12,3.86 1.91,2.64 11.98,19.78 11.53,19.88 2.34,2.46 11.86,3.54 0.92,0.39 0.49,0.55 0.45,2.57 0.68,6.18 15.12,0.78 15.44,1.49 15.38,2.72 15.52,3.34 15.48,2.2 15.05,2.06 12.38,1.68 9.11,4.02 5.93,3.69 4.82,4.09 4.76,2.93 3.88,2.95 4.17,8.72 1.06,11.42 0.52,11.57 0.53,12.79 0.5,13.54 0.35,14.35 0.6,15.8 15.48,13.39 15.49,12.26 15.13,10.53 17.77,27.47 14.09,39.27 2.62,41.08 2.31,25.87 9.08,9.93 4.66,15.94 0.56,9.69 7.44,12.05 6.76,9.86 13.55,8.01 18.77,39.47 14.58,4.39 2.24,3.36 6.94,17.05 4.46,16.79 6.96,17.97 10.2,18.05 10.15,17.45 0.96,16.2 7.58,16.6 11.2,16.2 10.5,16.35 10.76,16.6 13.2,16.2 14.25,15.15 15.55,16.75 15.2,13.35 6.09,19.28 6.72,14.96 7.74,8.66 15.55,4.11 12.21,3.74 9.84,4.09 6.54,18.5 7.23,16.49 6.84,18.57 4.81,17.71 6.77,16.65 6.37,16.66 7.91,13 7.36,19.96 6.1,19.93 6.54,17.38 4.79,19.96 1.23,1.67 0.28,11.16 3.4,8 8.9,5.18 10.87,4.34 6.4,6.36 6.07,6.36 6.2,6.13 11.1,16.59 10.88,16.27 11.28,1.63 13.41,0.29 13.95,2.46 13.39,1.27 14.21,3.4 11.39,3.48 1.76,5.2 9.48,18.87 9.48,18.44 10.18,18.35 11.16,20.02 0.42,12.07 9.67,7.72 9.59,7.47 8.8,9.3 9.91,19.97 1.05,10.02 2.74,4.67 0.95,7.3 2.59,0.28 3.8,0.27 11.34,16.42 10.49,16.59 18.6,23.8 2.2,37.9 15.42,0.38 4.61,2.11 6.5,2.99 4.76,17.41 6.54,16.96
  pour LowSpeed (rank 2): 2.6,14.1 2.6,10.3 5.7,10.3 5.7,13.6 4.1,13.6 4.1,14.1
  pour GND2 (rank 3, no thermals): 0,20.15 0,-9.6 16,-9.6 16.05,15.75 16,20.15
  pour GND1 (rank 3): -42,58.5 -42,-8 58,-8 58,58.5
  pour LowSpeed (rank 3): 0,20.15 0,-11.65 16,-11.65 16.05,15.75 16,20.15
  pour Highspeed1 (rank 3): 0,20.15 0,-7.3 16,-7.3 16.05,15.75 16,20.15
  pour VCC (rank 4): 0,-9 16,-9 16,6 0,6
I2C_SCL_A  (via drill 0.1)
  Highspeed1 0.076: 8.05,2.98 v8.05,3 | 8.05,2.98 8.04,2.96 8.02,2.96 6.8,1.75 J3.19 | 8.05,2.98 8.63,3.56 10.41,3.56 11.61,4.76 11.61,5.51 11.48,5.64 11.48,6.8 12.3,7.62 U1.R9
  LowSpeed 0.076: R14.1 6.78,5.78 6.78,4.28 v8.05,3
I2C_SCL_B  (via drill 0.1)
  Highspeed1 0.076: U1.R14 14.84,7.76 v14.84,7.71
  Highspeed2 0.076: v14.84,7.71 14.96,7.59 14.96,5.95 14.79,5.79 v14.79,3.93 v14.79,3.92
  LowSpeed 0.076: 9.2,1.4 J5.19 9.2,1.53 9.52,1.85 10.66,1.85 11.38,2.57 12.29,2.57 | v14.84,7.71 15.1,7.71 R7.1 | 12.29,2.57 12.12,2.57 | 12.29,2.57 13.76,2.57 13.86,2.67 14.41,2.67 14.79,3.05 v14.79,3.92
I2C_SDA_A  (via drill 0.1)
  Highspeed1 0.076: 6.5,5.1 J3.18 6.5,5.06 6.18,4.74 v6.18,4.42 | U1.L6 v10.8,9.78
  Highspeed2 0.076: v6.18,4.42 6.18,4.71 6.88,5.42 6.88,5.93 7.76,6.81 8.28,6.81 8.68,7.21 8.93,7.21 9.15,7.44 9.15,8.13 9.38,8.36 9.38,9.7 9.74,10.05 10.53,10.05 v10.8,9.78
  LowSpeed 0.076: v6.18,4.42 6.2,4.44 6.2,5.48 5.86,5.82 R10.1
I2C_SDA_B  (via drill 0.1)
  Highspeed2 0.076: U1.M8 11.8,8.9 10.9,8 10.9,6.65 9.8,5.55 9.8,5.4 v9.1,4.69
  LowSpeed 0.076: 9.5,5.1 J5.18 9.5,5.09 v9.1,4.69 9.54,5.13 9.54,5.29 | R4.1 10.75,8.8 10.87,8.93 11.63,8.93 11.8,9.1 U1.M8
  other vias: 11.8,9.3
JTAGEN  (via drill 0.1)
  LowSpeed 0.076: R5.2 U1.G7
  other vias: 11.3,11.8
LH_DATA0  (via drill 0.1)
  Highspeed2 0.076: U14.C1 6,7.7 6.35,7.7 7.2,8.55 7.2,9.2 8.59,10.59 8.79,10.59 8.8,10.6 9.3,10.6 9.51,10.81 9.51,10.99 10.3,11.78 U1.G5
  other vias: 5.9,7.6 10.3,11.8
LH_DATA1  (via drill 0.1)
  Highspeed1 0.076: U1.H3 9.3,11.43 v9.25,11.48
  Highspeed2 0.076: v9.25,11.48 9.25,11.4 8.87,11.02 8.27,11.02 6.84,9.59 6.43,9.59 5.92,9.08 5.92,9.02 5.79,8.9 5.7,8.9 5.7,8.89 5.1,8.89 4.52,8.32 3.2,8.32 2.88,8 2.88,7.52 U13.C1
  other vias: 2.9,7.5
LH_DATA2  (via drill 0.1)
  LowSpeed 0.076: U1.B11 13.8,14.8 U15.C1
  other vias: 13.3,14.3
LH_ENV0  (via drill 0.1)
  Highspeed1 0.076: v5.8,7.31 6.11,7.31 U14.C2
  Highspeed2 0.076: U1.F5 10.3,12.2 10.54,11.96 10.54,11.64 10.21,11.32 9.85,10.96 9.85,10.79 9.46,10.4 8.8,10.4 7.5,9.1 7.5,8.55 6.41,7.46 6.14,7.46 5.98,7.3 v5.81,7.3 v5.8,7.31
  other vias: 10.3,12.3
LH_ENV1  (via drill 0.1)
  Highspeed1 0.076: U1.J2 v8.7,10.8
  Highspeed2 0.076: U13.C2 3.79,7.89 4.5,7.89 5.26,8.65 5.79,8.65 6.47,9.34 6.94,9.34 8.4,10.8 v8.7,10.8
  other vias: 3.4,7.5
LH_ENV2  (via drill 0.1)
  Highspeed1 0.076: U1.B13 14.35,14.35 v14.35,14.5
  LowSpeed 0.076: U15.C2 14.6,14.75 v14.35,14.5
MIDFILT
  Highspeed1 0.076: R27.1 8.61,15.65 8.26,16 L10.2
  Highspeed1 0.5: 8.52,17.58 8.55,17.61 8.55,17.9 | 8.55,17.9 L9.1 8.55,17.9 | 8.32,17.67 8.55,17.9 | 8.55,17.9 8.55,17.39 | L10.2 8.12,17.47 8.55,17.9
N$1
  LowSpeed 0.076: U12.1 12.25,7.7 12.12,7.58 U11.3
N$2
  LowSpeed 0.076: R28.1 U12.4
N$3  (via drill 0.1)
  Highspeed1 0.076: 11.6,0.7 J3.35 | J3.35 11.6,0.31 11.61,0.3 | J3.35 11.6,1.35 12.4,2.15 12.64,2.15 14.89,4.4 14.89,5.54 14.65,5.79 14.4,5.79 13.88,6.3 13.88,7.01 13.9,7.03 v13.9,7.47
  LowSpeed 0.076: v13.9,7.47 13.71,7.66 R31.2
N$4  (via drill 0.1)
  LowSpeed 0.2: L3.2 8.53,10.37 8.1,10.8 C17.1 C13.1 | C13.1 8.14,11.41 | 8.62,11.6 C20.1 | 8.62,11.6 8.62,11.48 U1.H2 | C13.1 8.47,11.45 8.62,11.6
  other vias: 8.8,11.3
N$5  (via drill 0.1)
  Highspeed1 0.076: v13.37,5.59 13.37,4.32 12.11,3.06 8.86,3.06 v8.77,2.98
  Highspeed2 0.076: v8.77,2.98 8.63,2.98 7.54,1.89 v4.92,1.89 v4.91,1.88
  LowSpeed 0.076: R28.2 13.58,5.9 13.37,5.69 v13.37,5.59 | v4.91,1.88 4.4,1.37 J5.35
N$6
  LowSpeed 0.076: R31.1 13.55,7.06 13.07,7.54 12.79,7.54 12.65,7.69 U12.2
N$7
  Highspeed1 0.076: 3.7,6.7 3.7,6.6 | D4.C 3.7,6.5 3.7,6.7 | 3.7,6.7 3.7,6.75 3.66,6.79 3.66,8.26 U13.A3
N$8
  Highspeed1 0.076: D4.A 2.45,6.3 3.15,7 3.15,8.25 U13.A2
N$9
  Highspeed1 0.2: U13.B1 2.4,7.5 R32.2
N$10
  cutout GND1: 0,18.4 arc-90 2,20.4 arc-90 4,18.4 arc-90 2,16.4 arc-90
N$11
  cutout LowSpeed: 0,18.4 arc-90 2,20.4 arc-90 4,18.4 arc-90 2,16.4 arc-90
N$12
  Highspeed1 0.2: U13.A1 2.55,8.15 C60.1
N$13  (via drill 0.1, 0.3)
  Highspeed1 0.076: L9.2 11.15,17.7 v11.25,17.7 | v9.44,16.94 9.44,16.52 R27.2
  Highspeed2 0.076: v11.25,17.7 10.75,17.2 9.7,17.2 v9.44,16.94
  LowSpeed 0.3: 11.33,17.7 v11.25,17.7 L8.1 11.58,18.06 C58.1
N$14  (via drill 0.1)
  Highspeed1 0.076: D5.C 12.8,6.75 v13.25,6.75 | 6.93,8.6 U14.A3
  Highspeed2 0.076: v13.25,6.75 13.25,6.68 13.04,6.47 12.93,6.35 12.93,4.5 12.43,4 12.43,3.65 11.62,2.85 10.5,2.85 9.01,1.36 4.52,1.36 4.35,1.53 4.35,6.41 6.54,8.6 U14.A3 6.93,8.6
  other vias: 6.9,8.6
N$15  (via drill 0.1)
  Highspeed1 0.076: 14.65,6.51 14.57,6.51 14.46,6.4 v14.18,6.4 | 14.65,6.51 14.77,6.4 | v6.5,9.06 6.5,8.7 U14.A2 | D5.A 14.65,6.55 14.65,6.51
  Highspeed2 0.076: v14.18,6.4 13.19,6.4 13.08,6.29 13.08,5.75 | v6.5,9.06 6.5,8.77 4.2,6.47 4.2,1.47 4.46,1.21 9.07,1.21 10.56,2.7 11.69,2.7 12.58,3.59 12.58,3.94 13.08,4.44 13.08,5.75 | 13.08,5.79 13.08,5.75
N$16
  Highspeed1 0.2: U14.B1 R33.2
N$17
  cutout VCC: 0,18.4 arc-90 2,20.4 arc-90 4,18.4 arc-90 2,16.4 arc-90
N$18
  cutout GND2: 0,18.4 arc-90 2,20.4 arc-90 4,18.4 arc-90 2,16.4 arc-90
N$19
  cutout Highspeed1: 0,18.4 arc-90 2,20.4 arc-90 4,18.4 arc-90 2,16.4 arc-90
N$20
  cutout GND1: 12,18.4 arc-90 14,20.4 arc-90 16,18.4 arc-90 14,16.4 arc-90
N$21
  cutout LowSpeed: 12,18.4 arc-90 14,20.4 arc-90 16,18.4 arc-90 14,16.4 arc-90
N$22
  cutout VCC: 12,18.4 arc-90 14,20.4 arc-90 16,18.4 arc-90 14,16.4 arc-90
N$23
  cutout GND2: 12,18.4 arc-90 14,20.4 arc-90 16,18.4 arc-90 14,16.4 arc-90
N$24
  cutout Highspeed1: 12,18.4 arc-90 14,20.4 arc-90 16,18.4 arc-90 14,16.4 arc-90
N$25
  cutout GND1: 2.65,21.4 2.65,20.2 13.25,20.2 13.25,21.4
N$26  (via drill 0.1)
  Highspeed1 0.076: 12.15,16.2 D6.C 11.95,15.7 12.46,15.7 13.05,15.7 13.75,15 13.75,14.71 14.05,14.41 14.05,14.25 | 14.05,14.22 14.05,14.25 | 14.05,14.25 14.05,14.21 14.2,14.06 14.97,14.06 v15.03,14.01
  LowSpeed 0.076: U15.A3 15.1,13.94 v15.03,14.01
N$27  (via drill 0.1)
  Highspeed1 0.076: D6.A 9.95,16.1 10.6,15.45 11.54,15.45 11.55,15.44 12.35,15.44 12.46,15.55 12.52,15.55 12.98,15.55 13.56,14.97 13.56,14.2 13.7,14.06 13.9,14.06 14.06,13.9 14.4,13.9 v14.5,13.8
  LowSpeed 0.076: U15.A2 v14.5,13.8
N$28
  Highspeed1 0.15: 1,12.78 C49.2 C49.2 arc45 0.8,12.32 arc66 1.14,11.8 1.25,11.75 U5.13
N$29
  LowSpeed 0.076: U15.B1 13.5,13.7 R34.2
N$30  (via drill 0.1)
  Highspeed1 0.076: 1.83,13.82 U5.9 v1.8,13.78
  LowSpeed 0.076: C55.1 R22.2 1.5,14.5 1.5,14.08 v1.8,13.78
N$31  (via drill 0.1)
  Highspeed1 0.15: v1.16,12.3 1.71,12.3 U5.12
  LowSpeed 0.15: C50.2 1.05,12.41 v1.16,12.3
N$32
  LowSpeed 0.15: C50.1 R23.2
N$33  (via drill 0.1)
  Highspeed1 0.076: U5.8 v2.41,14.6
  LowSpeed 0.076: R26.1 R25.2 2.43,14.93 C57.1 2.43,14.58 v2.41,14.6
N$34  (via drill 0.1)
  Highspeed1 0.2: U5.10 2.26,13.25 v2.31,13.3
  LowSpeed 0.076: C44.1 v2.31,13.3
  LowSpeed 0.2: C44.1 C40.1 2.97,14.37 L6.2 3.58,14.75 3.8,14.75 3.89,14.83 C52.1
N$35  (via drill 0.2)
  Highspeed1 0.2: U5.14 v2.23,11.26
  LowSpeed 0.2: C46.1 2.37,11.27 C54.1 2.32,10.65 L7.2 | C46.1 C42.1 | C46.1 2.27,11.3 v2.23,11.26
N$36
  Highspeed1 0.2: U14.A1 5.3,8.6 C61.1
N$37
  LowSpeed 0.2: U15.A1 13.93,13.62 13.93,13.32 13.8,13.2 C62.1
N$38  (via drill 0.2)
  VCC 0.3: v7.86,14.53 8.74,15.41 8.74,16.35 9.12,16.73 v9.12,16.74
  LowSpeed 0.1: 9.9,16.52 9.9,16.48 9.88,16.46
  LowSpeed 0.2: C36.1 9.94,16.14 U6.3 10.07,16.34 9.9,16.52 9.9,16.68 10.07,16.86 U6.4 10.07,16.91 | U3.7 5.83,18.22
  LowSpeed 0.3: U3.8 5.83,18.22 U3.6 5.31,17.52 5.2,17.41 5.2,16.78 5.73,16.25 5.73,15.68 U7.B1 U7.B2 U7.B3 U7.A3 7.89,14.5 v7.86,14.53 | 9.95,15.3 9.94,15.31 C36.1 | v9.12,16.74 9.18,16.68 | C28.1 8.78,17.08 v9.12,16.74 | v9.12,16.74 9.2,16.66 C26.1 9.88,16.46 9.96,16.38
N$39  (via drill 0.1)
  Highspeed1 0.076: 0.6,7.72 U4.B1 0.18,8.12 0.18,8.44 0.23,8.49 v0.23,9.13
  LowSpeed 0.076: C30.1 0.23,9.87 v0.23,9.13
N$40
  LowSpeed 0.076: U9.B1 1.01,8.76 1.28,9.03 1.28,9.25 1.1,9.43 C43.1
N$41
  LowSpeed 0.076: R21.1 C38.1 1.03,6.38 1.21,6.56 1.21,8.14 U9.C1
N$67
  LowSpeed 0.076: U10.9 4.75,6.1 4.55,5.9 C39.2
N$92  (via drill 0.1)
  Highspeed1 0.076: D2.2 13.85,15.65 v13.75,15.55
  LowSpeed 0.076: R6.2 v13.75,15.55
N$93  (via drill 0.1)
  Highspeed1 0.076: D1.2 15,15.65 v14.9,15.75
  LowSpeed 0.076: v14.9,15.75 14.9,15.7 R3.2
NCONFIG  (via drill 0.1)
  Highspeed1 0.076: U1.E8 12.15,12.45 v12.3,12.45
  LowSpeed 0.076: 12.36,12.51 v12.3,12.45 12.33,12.45 R16.2
NP_OSC_EN  (via drill 0.1)
  Highspeed1 0.076: U1.P8 11.86,8.25 11.86,7.52 10.52,6.18 v10.52,5.93
  LowSpeed 0.076: U11.1 v10.52,5.93
NRST  (via drill 0.1)
  Highspeed1 0.076: v15.5,7.5 15.54,7.54 15.54,8.06 U1.P15 | J3.15 5.62,0.79 5.62,2.31 5.87,2.56 v5.89,2.56 | v10.28,1.58 10.28,1.98 v10.48,2.18 | U4.C1 0.36,7.06 0.33,7.06 0.27,6.99 0.27,5.43 0.37,5.32 v0.37,5.1
  Highspeed2 0.076: v15.5,7.5 15.21,7.21 15.21,4.04 14.74,3.57 v14.51,3.57
  LowSpeed 0.076: 10.4,1.3 10.4,1.1 | 10.4,1.1 J5.15 10.4,1.46 v10.28,1.58 | 10.29,1.21 10.4,1.1 | v14.51,3.57 14.51,3.25 14.12,2.86 11.16,2.86 v10.48,2.18 7.27,2.18 6.88,2.57 v5.9,2.57 v5.89,2.56 4.58,2.56 4.08,2.06 2.92,2.06 2.91,2.06 1.79,2.06 0.37,3.48 v0.37,5.1 0.37,5.67 R21.2
NSTATUS  (via drill 0.1)
  LowSpeed 0.076: 10.9,13.3 U1.D6
  other vias: 10.8,13.3
OSC_PDOWN_N_A  (via drill 0.1)
  Highspeed1 0.076: v4.7,4.6 J3.12 | v8.29,7.47 8.38,7.56 8.4,7.56 8.54,7.7 8.54,7.89 8.71,8.06 9.06,8.06 U1.P3
  Highspeed2 0.076: v4.7,4.6 4.7,5.86 5.52,6.68 6.83,6.68 7.44,7.29 8,7.29 | 8,7.29 8.08,7.29 | v8.29,7.47 8.11,7.29 8,7.29
OSC_PDOWN_N_B  (via drill 0.1)
  Highspeed1 0.076: U1.L10 v12.8,9.78
  Highspeed2 0.076: v12.8,9.78 12.8,9.05 13.02,8.83 13.02,8.22 12.4,7.6 12.4,6.57 11.87,6.04 11.87,5.32 11.3,4.75 v11.3,4.12
  LowSpeed 0.1: v11.3,4.12 J5.12
PSB_CLK_A  (via drill 0.1)
  Highspeed1 0.076: v11.42,2.26 11,1.84 J3.33
  Highspeed2 0.076: U1.K4 9.98,10.48 13,10.48 13.22,10.25 13.22,9.79 13.8,9.21 13.8,7.94 14.47,7.27 14.47,6.32 13.4,5.25 13.4,3.7 11.96,2.26 v11.42,2.26
  other vias: 9.8,10.3
PSB_CLK_B  (via drill 0.1)
  Highspeed2 0.076: U1.L4 10.07,9.53 10.07,8.4 10.1,8.37 10.1,7.3 7.67,4.87 7.67,4.79 v5.19,2.31
  LowSpeed 0.076: v5.19,2.31 5.19,1.53 5,1.34 J5.33
  other vias: 9.8,9.8
PSB_DATA_0_A  (via drill 0.1)
  Highspeed1 0.076: v14.56,7.49 14.3,7.75 U1.R13 | J3.31 10.4,1.35 v10.61,1.56
  Highspeed2 0.076: v10.61,1.56 10.95,1.9 12.2,1.9 12.27,1.98 12.28,1.98 14.05,3.75 14.05,5.45 14.72,6.12 14.72,7.34 v14.56,7.49
PSB_DATA_0_B  (via drill 0.1)
  Highspeed1 0.076: U1.L7 v11.3,9.77
  Highspeed2 0.076: v11.3,9.77 11.3,9.11 10.7,8.51 10.7,6.85 9.58,5.73 9.58,5.53 v6.19,2.14
  LowSpeed 0.076: v6.19,2.14 5.6,1.55 J5.31
PSB_DATA_1_A
  Highspeed1 0.076: J3.30 10.15,5.22 10.15,6.32 11.54,7.7 11.54,8.06 U1.P7
PSB_DATA_1_B  (via drill 0.1)
  Highspeed2 0.076: U1.M4 9.8,8.4 9.9,8.3 9.9,7.46 7.44,5 7.44,4.95 6.49,4 v6.25,4
  LowSpeed 0.076: J5.30 5.9,4.35 v6.25,4
  other vias: 9.8,9.3
PSB_DATA_2_A
  Highspeed1 0.076: 9.5,5.38 9.5,5.5 | 9.5,5.38 J3.28 9.5,5.38 | U1.P6 10.8,7.9 9.5,6.6 9.5,5.38
PSB_DATA_2_B  (via drill 0.1)
  Highspeed1 0.076: U1.P4 v9.64,8.14
  Highspeed2 0.076: v6.5,4.45 7.12,5.07 7.12,5.77 7.92,6.57 8.47,6.57 8.89,6.99 9.08,6.99 9.37,7.27 9.37,7.72 9.64,8 v9.64,8.14
  LowSpeed 0.076: J5.28 v6.5,4.45
PSB_DATA_3_A
  Highspeed1 0.076: J3.27 9.2,1.62 10.09,2.51 12.46,2.51 14.21,4.25 14.21,4.33 14.59,4.72 14.59,5.5 14.5,5.61 14.21,5.61 13.68,6.13 13.68,7.79 13.8,7.9 U1.P12
PSB_DATA_3_B  (via drill 0.1)
  Highspeed1 0.076: U1.L8 v11.85,9.75 v11.86,9.75
  Highspeed2 0.076: v6.8,2.1 9.18,4.48 9.19,4.48 9.8,5.09 9.98,5.09 11.1,6.21 11.1,6.86 11.27,7.03 11.27,7.92 12.05,8.7 12.05,9.56 v11.86,9.75
  LowSpeed 0.076: J5.27 v6.8,2.1
PSB_DATA_4_A
  Highspeed1 0.076: J3.25 8.59,0.78 8.59,1.75 9.62,2.79 12.25,2.79 14,4.54 14,5.48 13.46,6.01 13.46,7.63 U1.R11
PSB_DATA_4_B  (via drill 0.1)
  Highspeed1 0.076: U1.L9 v12.3,9.78
  Highspeed2 0.076: v7.9,1.8 8.09,1.8 10.27,3.98 10.27,4.5 11.6,5.83 11.6,6.6 11.91,6.91 11.91,7.61 12.55,8.25 12.55,9.53 v12.3,9.78
  LowSpeed 0.076: v7.9,1.8 7.4,1.3 J5.25
PSB_DATA_5_A
  Highspeed1 0.076: J3.24 8.3,5.16 9.05,4.4 9.41,4.4 9.82,4.81 9.82,6.49 11.13,7.8 U1.R7
PSB_DATA_5_B  (via drill 0.1)
  Highspeed2 0.076: U1.M5 10.3,7.17 7.92,4.79 v7.92,4.66
  LowSpeed 0.076: J5.24 7.7,4.88 v7.92,4.66
  other vias: 10.3,9.3
PSB_DATA_6_A
  Highspeed1 0.076: J3.22 7.7,5.3 8,5.6 8.68,5.6 8.75,5.67 8.75,6.11 9.13,6.49 9.13,6.69 10.24,7.8 U1.R5 10.2,7.8
PSB_DATA_6_B  (via drill 0.1)
  Highspeed1 0.076: v10.59,9.55 11.05,9.55 U1.M7
  Highspeed2 0.076: v10.59,9.55 10.59,8.76 10.51,8.68 10.51,7 8.95,5.44 8.85,5.44 8.69,5.27 8.69,5 v8.18,4.49
  LowSpeed 0.076: J5.22 8.3,4.61 v8.18,4.49
PSB_SYNC_A
  Highspeed1 0.076: J3.21 7.4,1.91 8.79,3.29 10.79,3.29 12.21,4.71 12.21,5.47 12.05,5.63 11.83,5.63 11.7,5.76 11.7,6.71 11.8,6.81 11.86,6.81 12.59,7.55 12.59,8 U1.P9
PSB_SYNC_B  (via drill 0.1)
  Highspeed1 0.076: v13.23,9.42 13.3,9.35 U1.M11
  Highspeed2 0.076: v9,1.8 10.4,3.2 10.73,3.2 12.2,4.67 12.2,5.9 12.68,6.38 12.68,6.83 13.3,7.45 13.3,9.35 v13.23,9.42
  LowSpeed 0.076: J5.21 8.6,1.4 v9,1.8
REC_NRST_A  (via drill 0.1)
  Highspeed1 0.076: J3.16 5.9,4.91 v5.64,4.65 | U1.R3 9.21,7.8 v8.94,7.53
  Highspeed2 0.076: v8.94,7.53 8.68,7.53 8.17,7.02 7.53,7.02 6.67,6.16 6.67,5.68 v5.64,4.65
REC_NRST_B  (via drill 0.1)
  Highspeed2 0.076: U1.M9 12.32,9.28 12.32,8.5 11.54,7.72 11.54,6.96 11.3,6.71 11.3,6 10.07,4.77 v10.07,4.64
  LowSpeed 0.076: J5.16 10.1,4.67 v10.07,4.64
  other vias: 12.3,9.3
SER_DIN0  (via drill 0.1)
  Highspeed1 0.076: U5.19 v3.4,9.14 | U1.B8 v11.8,14.16
  Highspeed2 0.076: v3.4,9.14 4.25,9.99 4.79,9.99 6.46,11.66 6.46,12.25 7.81,13.6 8.16,13.6 8.65,14.09 8.9,14.09 8.91,14.1 10.2,14.1 10.21,14.09 10.39,14.09 10.4,14.1 11.74,14.1 v11.8,14.16
SER_DIN1  (via drill 0.1)
  Highspeed1 0.076: v4,9.1 3.91,9.19 U5.20 | U1.C8 11.8,13.66 v11.74,13.6
  Highspeed2 0.076: v4,9.1 4,9.24 4.43,9.67 4.77,9.67 6.7,11.6 6.7,12.15 7.88,13.34 8.33,13.34 8.89,13.89 11.44,13.89 v11.74,13.6
SER_DIN2  (via drill 0.1)
  Highspeed1 0.076: U5.21 v4.4,9.13 | U1.B4 9.71,14.3 v9.09,13.68
  Highspeed2 0.076: v4.4,9.13 4.71,9.45 4.85,9.45 6.92,11.53 6.92,11.88 7.55,12.5 7.91,12.5 v9.09,13.68
SER_DIN3  (via drill 0.1)
  Highspeed1 0.076: U5.22 v4.9,9.1 | U1.B6 v10.18,13.68
  Highspeed2 0.076: v10.18,13.68 10.02,13.52 9.63,13.52 9.07,12.96 8.7,12.96 4.9,9.16 v4.9,9.1
SER_DIN4  (via drill 0.1)
  Highspeed1 0.076: U1.B7 11.26,14.3 v10.64,13.68 | U5.23 5.41,9.18 v5.35,9.12
  Highspeed2 0.076: v10.64,13.68 10.53,13.56 10.53,13.18 10.35,13 9.45,13 9.15,12.7 9.15,12.66 7.98,11.5 7.65,11.5 7.42,11.27 7.41,11.27 7.29,11.14 7.29,11.13 5.35,9.2 v5.35,9.12
SER_DIN5  (via drill 0.1)
  Highspeed1 0.076: U5.24 5.91,9.32 v5.7,9.11
  Highspeed2 0.076: v5.7,9.11 5.7,9.19 6.59,10.08 7.09,10.08 7.09,10.09 7.1,10.09 7.22,10.21 7.22,10.22 7.39,10.39 7.39,10.56 8.08,11.25 8.25,11.25 9.36,12.35 9.58,12.35 9.8,12.57 10.97,12.57 11.29,12.89 12.39,12.89 U1.D10
  other vias: 12.8,13.3
SER_DIN6
  Highspeed1 0.076: U5.26 6.71,10.75 7.42,11.46 7.42,11.62 7.9,12.1 7.95,12.1 8.65,12.8 U1.E2
SER_DIN7
  Highspeed1 0.076: U5.27 6.71,11.25 7.15,11.69 7.15,12.06 7.87,12.79 8.29,12.79 U1.E1
SER_DIN8
  Highspeed1 0.076: U1.D2 8.7,13.3 8.63,13.23 7.75,13.23 6.77,12.25 U5.29
SER_DIN9
  Highspeed1 0.076: U1.C2 8.5,13.5 7.7,13.5 6.95,12.75 U5.30
SER_DIN10
  Highspeed1 0.076: U1.C1 8.25,13.85 8.25,13.9 7.4,13.9 6.74,13.25 U5.31
SER_DIN11
  Highspeed1 0.076: U5.32 6.85,13.75 7.37,14.27 8.27,14.27 U1.B1
SER_GPIO0  (via drill 0.1)
  Highspeed1 0.076: U5.15 2.05,10.75 2.19,10.61 2.19,10.07 2.1,9.98 2.1,9.23 v2.23,9.1 | v11.12,14.98 U1.A7
  Highspeed2 0.076: v11.12,14.98 10.97,15.13 7.53,15.13 6.85,14.45 6.85,14.35 6.65,14.15 6.55,14.15 5.3,12.9 5.3,11.5 4.6,10.8 3.3,10.8 2.23,9.73 v2.23,9.1
SER_GPIO1  (via drill 0.1)
  Highspeed1 0.076: U5.16 | U5.16 1.59,10.25 | v12.51,14.94 12.37,14.8 U1.A9 | U5.16 1.09,10.25 TP8.TP | U5.16 v1.94,10.25
  Highspeed2 0.076: v12.51,14.94 12.31,14.94 12.23,14.87 11.81,14.87 11.33,15.34 6.8,15.34 5.46,14 5.46,13.96 5.1,13.6 5.1,11.6 4.5,11 3,11 2.25,10.25 v1.94,10.25
SER_GPIO2  (via drill 0.1)
  Highspeed1 0.076: U5.17 2.41,9.29 v2.6,9.1 2.6,9.05 R19.1 | U1.B14 14.8,14.44 v14.85,14.49
  Highspeed2 0.076: v2.6,9.1 2.6,9.7 3.5,10.6 4.7,10.6 5.5,11.4 5.5,12.66 7.64,14.8 10.92,14.8 10.98,14.74 11.61,14.74 11.66,14.69 12.84,14.69 12.95,14.8 14.54,14.8 v14.85,14.49
SER_GPIO3  (via drill 0.1)
  Highspeed1 0.076: U5.18 2.91,9.2 v3,9.11 | U1.B12 v13.78,14.3
  Highspeed2 0.076: v3,9.11 3,9.7 3.7,10.4 4.8,10.4 5.7,11.3 5.7,12.4 7.4,14.1 8.06,14.1 8.48,14.52 9.06,14.52 9.25,14.32 9.63,14.32 9.82,14.52 11.3,14.52 11.32,14.5 11.95,14.5 12.43,14.03 13.5,14.03 v13.78,14.3
SER_HSYNC
  Highspeed1 0.076: U1.A2 8.55,15.04 7.55,15.04 6.65,14.15 5.91,14.15 U5.1
SER_PCLK  (via drill 0.1)
  Highspeed1 0.076: U5.3 4.91,14.71 v5.15,14.95 | v12.85,15.3 13.3,14.85 U1.A11
  Highspeed2 0.076: v5.15,14.95 5.75,15.55 12.6,15.55 v12.85,15.3
SER_SCL  (via drill 0.1)
  Highspeed1 0.076: v5.15,13.96 4.55,13.96 4.41,14.1 U5.4 4.41,14.85 v4.85,15.29 v4.86,15.29 | U1.A13 v13.9,15.2
  Highspeed2 0.076: v13.9,15.2 13.4,15.2 12.84,15.76 5.33,15.76 v4.86,15.29
  LowSpeed 0.076: 5.11,13.9 R11.1 5.21,13.9 v5.15,13.96
SER_SDA  (via drill 0.1)
  Highspeed1 0.076: U5.5 3.91,14.79 | U5.5 v3.91,14.39 | U5.5 3.91,14.81 v4.4,15.3 | U1.A14 14.8,14.95 v14.55,15.2
  Highspeed2 0.076: v14.55,15.2 13.96,15.79 13.57,15.79 13.37,15.98 5.08,15.98 v4.4,15.3
  LowSpeed 0.076: v3.91,14.39 4.19,14.39 R15.1
SER_VSYNC
  Highspeed1 0.076: U5.2 5.41,14.71 6,15.3 8.8,15.3 U1.A3
SIGOUT
  Highspeed1 0.15: C49.1 1.04,13.48 arc-45 1.7,15.17 2.09,15.57 arc-45 3.79,16.27 D3.C | D3.C 5.67,16.27 5.77,16.37 | 5.77,17.05 J2.P$1
  Highspeed1 0.203: D3.C
  Highspeed1 0.5: J2.P$1 5.77,16.37 6.06,16.07 6.41,16.07 L10.1
STATUS_A  (via drill 0.1)
  Highspeed1 0.076: v15.33,16.51 15.33,16.07 D1.1 | U1.C15 15.3,13.95 v15.34,13.99
  Highspeed2 0.076: v15.33,16.51 15.49,16.35 15.49,14.14 v15.34,13.99
STATUS_B
  Highspeed1 0.076: U1.B15 15.3,14.35 15.06,14.59 15.06,15.22 14.54,15.74 14.54,15.8 14.29,16.05 D2.1
TCK  (via drill 0.1)
  Highspeed1 0.076: v7.1,10.6 7.3,10.8 U1.J1
  LowSpeed 0.076: 4.11,19.53 TP3.TP 4.19,16.38 R9.1 4.27,16.03 4.75,15.55 4.9,15.55 5.61,14.85 5.61,14.1 6.3,13.4 6.3,12.07 7.1,11.27 v7.1,10.6
  LowSpeed 0.1: 4.08,21.45 4.08,20.98 4.07,20.98 4.07,19.74 TP3.TP
  LowSpeed 0.2: J1.1 15.98,47.37 17.25,46.1 17.25,35.55 4.08,22.38 4.08,21.45
TDI  (via drill 0.1)
  Highspeed1 0.076: U1.H5 v10.29,11.11
  LowSpeed 0.076: 9.98,11.11 9.97,11.11 | 9.98,11.11 v10.29,11.11 | 8.04,19.62 TP4.TP 8.38,19.24 R13.2 8.38,18.66 8.27,18.54 8.27,16.54 8.44,16.37 8.44,13.82 8.79,13.46 9.16,13.46 9.28,13.34 9.28,11.8 9.98,11.11
  LowSpeed 0.1: TP4.TP 8,19.8 7.78,20.02 7.77,20.02 7.37,20.42 7.37,21.17 7.4,21.3
  LowSpeed 0.2: J1.9 7.38,49.12 18.73,49.12 20.05,47.8 20.05,36.45 7.4,23.8 7.4,21.3 | TP4.TP arc-90 7.77,19.85
TDO  (via drill 0.1)
  Highspeed1 0.076: U1.H4 9.29,11.81 9.29,13.49 v9.45,13.66
  Highspeed1 0.1: TP5.TP 6.73,20.07 7.08,20.42 7.08,21.3
  Highspeed1 0.2: J1.3 13.28,47.37 14.5,46.15 14.5,43.25 11.93,40.67 10.22,40.67 7,37.45 7,22.6 7.08,22.52 7.08,21.3
  Highspeed2 0.076: v8.57,16.8 8.57,17.78 TP5.TP
  LowSpeed 0.076: v9.45,13.66 9.24,13.87 9.24,14.81 9.12,14.93 8.84,14.93 8.68,15.09 8.68,16.69 v8.57,16.8
  other vias: 6.73,19.62
TMS  (via drill 0.1, 0.2)
  Highspeed1 0.076: U1.G1 8.05,11.8 v7.99,11.86
  Highspeed1 0.1: 5.5,21.3 5.5,19.96 v5.16,19.62
  Highspeed1 0.2: v4.75,37.2 5.5,36.45 5.5,21.3
  LowSpeed 0.076: v7.99,11.86 7.94,11.81 6.99,11.81 6.53,12.27 6.53,13.55 5.8,14.28 5.8,15.01 5.37,15.44 5.37,15.88 4.79,16.46 4.79,16.81 4.45,17.15 4.45,17.84 4.68,18.07 R8.2 4.84,18.07 5.12,18.35 5.12,19.28 TP2.TP 5.41,19.57 5.16,19.57
  LowSpeed 0.1: 5.16,19.32 5.16,19.57 v5.16,19.62
  LowSpeed 0.2: v4.75,37.2 4.75,39.3 9.35,43.9 9.35,46.02 J1.5
VCCA  (via drill 0.1, 0.2)
  Highspeed1 0.076: U1.N2 v8.82,8.82
  Highspeed1 0.2: v14.23,9.26 14.23,8.37 U1.P13 v14.3,8.34 | U1.D14 14.3,13.3 | C5.1 14.3,12.89 14.3,13.3 | v12.4,13.75 13.85,13.75 14.3,13.3 | U1.B3 v9.54,14.54
  Highspeed2 0.2: v14.23,9.26 13.9,9.59 13.9,12.49 C5.1
  VCC 0.2: v14.23,9.26 14.23,9.13 13.2,8.1 10.3,8.1 9.58,8.82 v8.82,8.82 | v9.54,14.54 10.11,13.97 11.5,13.97 11.6,13.88 11.98,13.88 12.11,13.75 v12.4,13.75
  LowSpeed 0.076: L1.2 14.27,9.3 v14.23,9.26 | C3.1 v8.83,8.81 v8.82,8.82
  LowSpeed 0.2: C7.1 14.27,8.37 v14.3,8.34 | C1.1 v9.54,14.54
  other vias: 14.27,12.86
VCCIO  (via drill 0.1, 0.2)
  Highspeed1 0.2: U1.B10 U1.B9 | U1.F14 U1.G14 14.49,11.8 v14.39,11.7 | U1.L14 14.8,9.86 14.49,10.17 14.49,10.51 v14.39,10.61
  Highspeed2 0.2: v14.39,11.7 14.68,11.99 14.68,13.12 14.06,13.74 14.06,14.44 13.91,14.58 13.07,14.58 U1.B10
  VCC 0.2: U1.B10 12.5,14.61 10.61,14.61 U1.B5
  LowSpeed 0.2: C10.1 13.92,10.61 v14.39,10.61 | v14.39,10.61 14.78,10.61 15.18,11.01 C22.1 | U1.B10 C15.1 | C19.1 U1.B5 | v14.39,10.61 v14.39,11.7 14.34,11.75 L5.2
  other vias: 10.3,14.3 12.8,14.3
VCCIO2  (via drill 0.1)
  Highspeed1 0.2: U1.P11 U1.P10 v12.8,8.57 v12.81,8.58 | U1.L2 v8.95,9.65 9.15,9.45 9.15,8.84 9.32,8.67 9.93,8.67 U1.P5 10.69,8.69 v11.22,8.69
  LowSpeed 0.2: C9.1 8.7,9.65 v8.95,9.65 | v11.22,8.69 11.22,8.25 C21.1 11.61,8.58 v12.81,8.58 12.94,8.45 C18.1 C14.1 14.2,7.88 L4.2
VCCIOA  (via drill 0.1)
  Highspeed1 0.2: U1.F2 8.8,12.35 v8.65,12.5
  LowSpeed 0.2: C12.1 | L2.2 6.96,12.6 C23.1 7.76,12.55 C12.1 | C12.1 8.37,12.5 v8.65,12.5 8.87,12.5 C16.1
VCOAX  (via drill 0.3)
  Highspeed2 0.4: J4.1 3.4,30.05 v9.6,23.85
  VCC 0.4: v7.5,18.25 8.02,17.73 L8.2
  LowSpeed 0.2: TP1.TP 10.35,19.81 10.35,21.25 9.6,22 9.6,22.15 | 9.65,17.71 9.67,17.73
  LowSpeed 0.3: 9.6,23.9 v9.6,23.85 | 9.67,17.73 L8.2 9.65,17.77 9.65,18 9.84,18.19 9.84,18.59 C25.1 10,19.08 TP1.TP 10.46,19.62 | U3.1 7.65,18.3 | 7.65,18.3 U3.2 7.57,18.02 | 7.65,18.3 7.6,18.25 v7.5,18.25
  LowSpeed 0.4: 9.6,22.15 v9.6,23.85
  other vias: 9.61,17.73

## Text on the board
tPlace: JTAG | GND | GND | +5.0V | GND | GND | EXT POW / No coax! | 1
bPlace: hs-neuropix / Rev. 1.3 JPN '20 | G LINK | G LINK